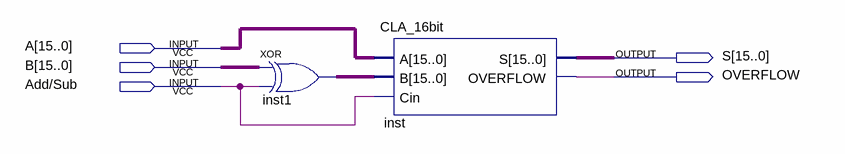
[diagram p0: schematic sheet]
// Quartus schematic Adder_Subtractor_16bit.bdf as structural Verilog: 2 symbols, 5 pins
module Adder_Subtractor_16bit (
  input  [15:0] A,
  input  [15:0] B,
  input  \Add/Sub ,
  output [15:0] S,
  output OVERFLOW
);

  wire [15:0] inst1_out;

  assign inst1_out = B ^ {16{\Add/Sub }};  // XOR inst1, 16 bits wide
  CLA_16bit inst (.A(A), .B(inst1_out), .Cin(\Add/Sub ), .S(S), .OVERFLOW(OVERFLOW));
endmodule
